# EasyEDA Pro project ProDoc_接收端.epro

# Schematic Schematic1

## Sheets
1 P1: Board Name: 接收端; Create Date: 2025-08-29; Page Name: P1; Project Name: thu硬设魔杖; Schematic Name: Schematic1; Update Date: 2025-08-30; Company: 嘉立创EDA; Page Size: A4; Version: V1.0
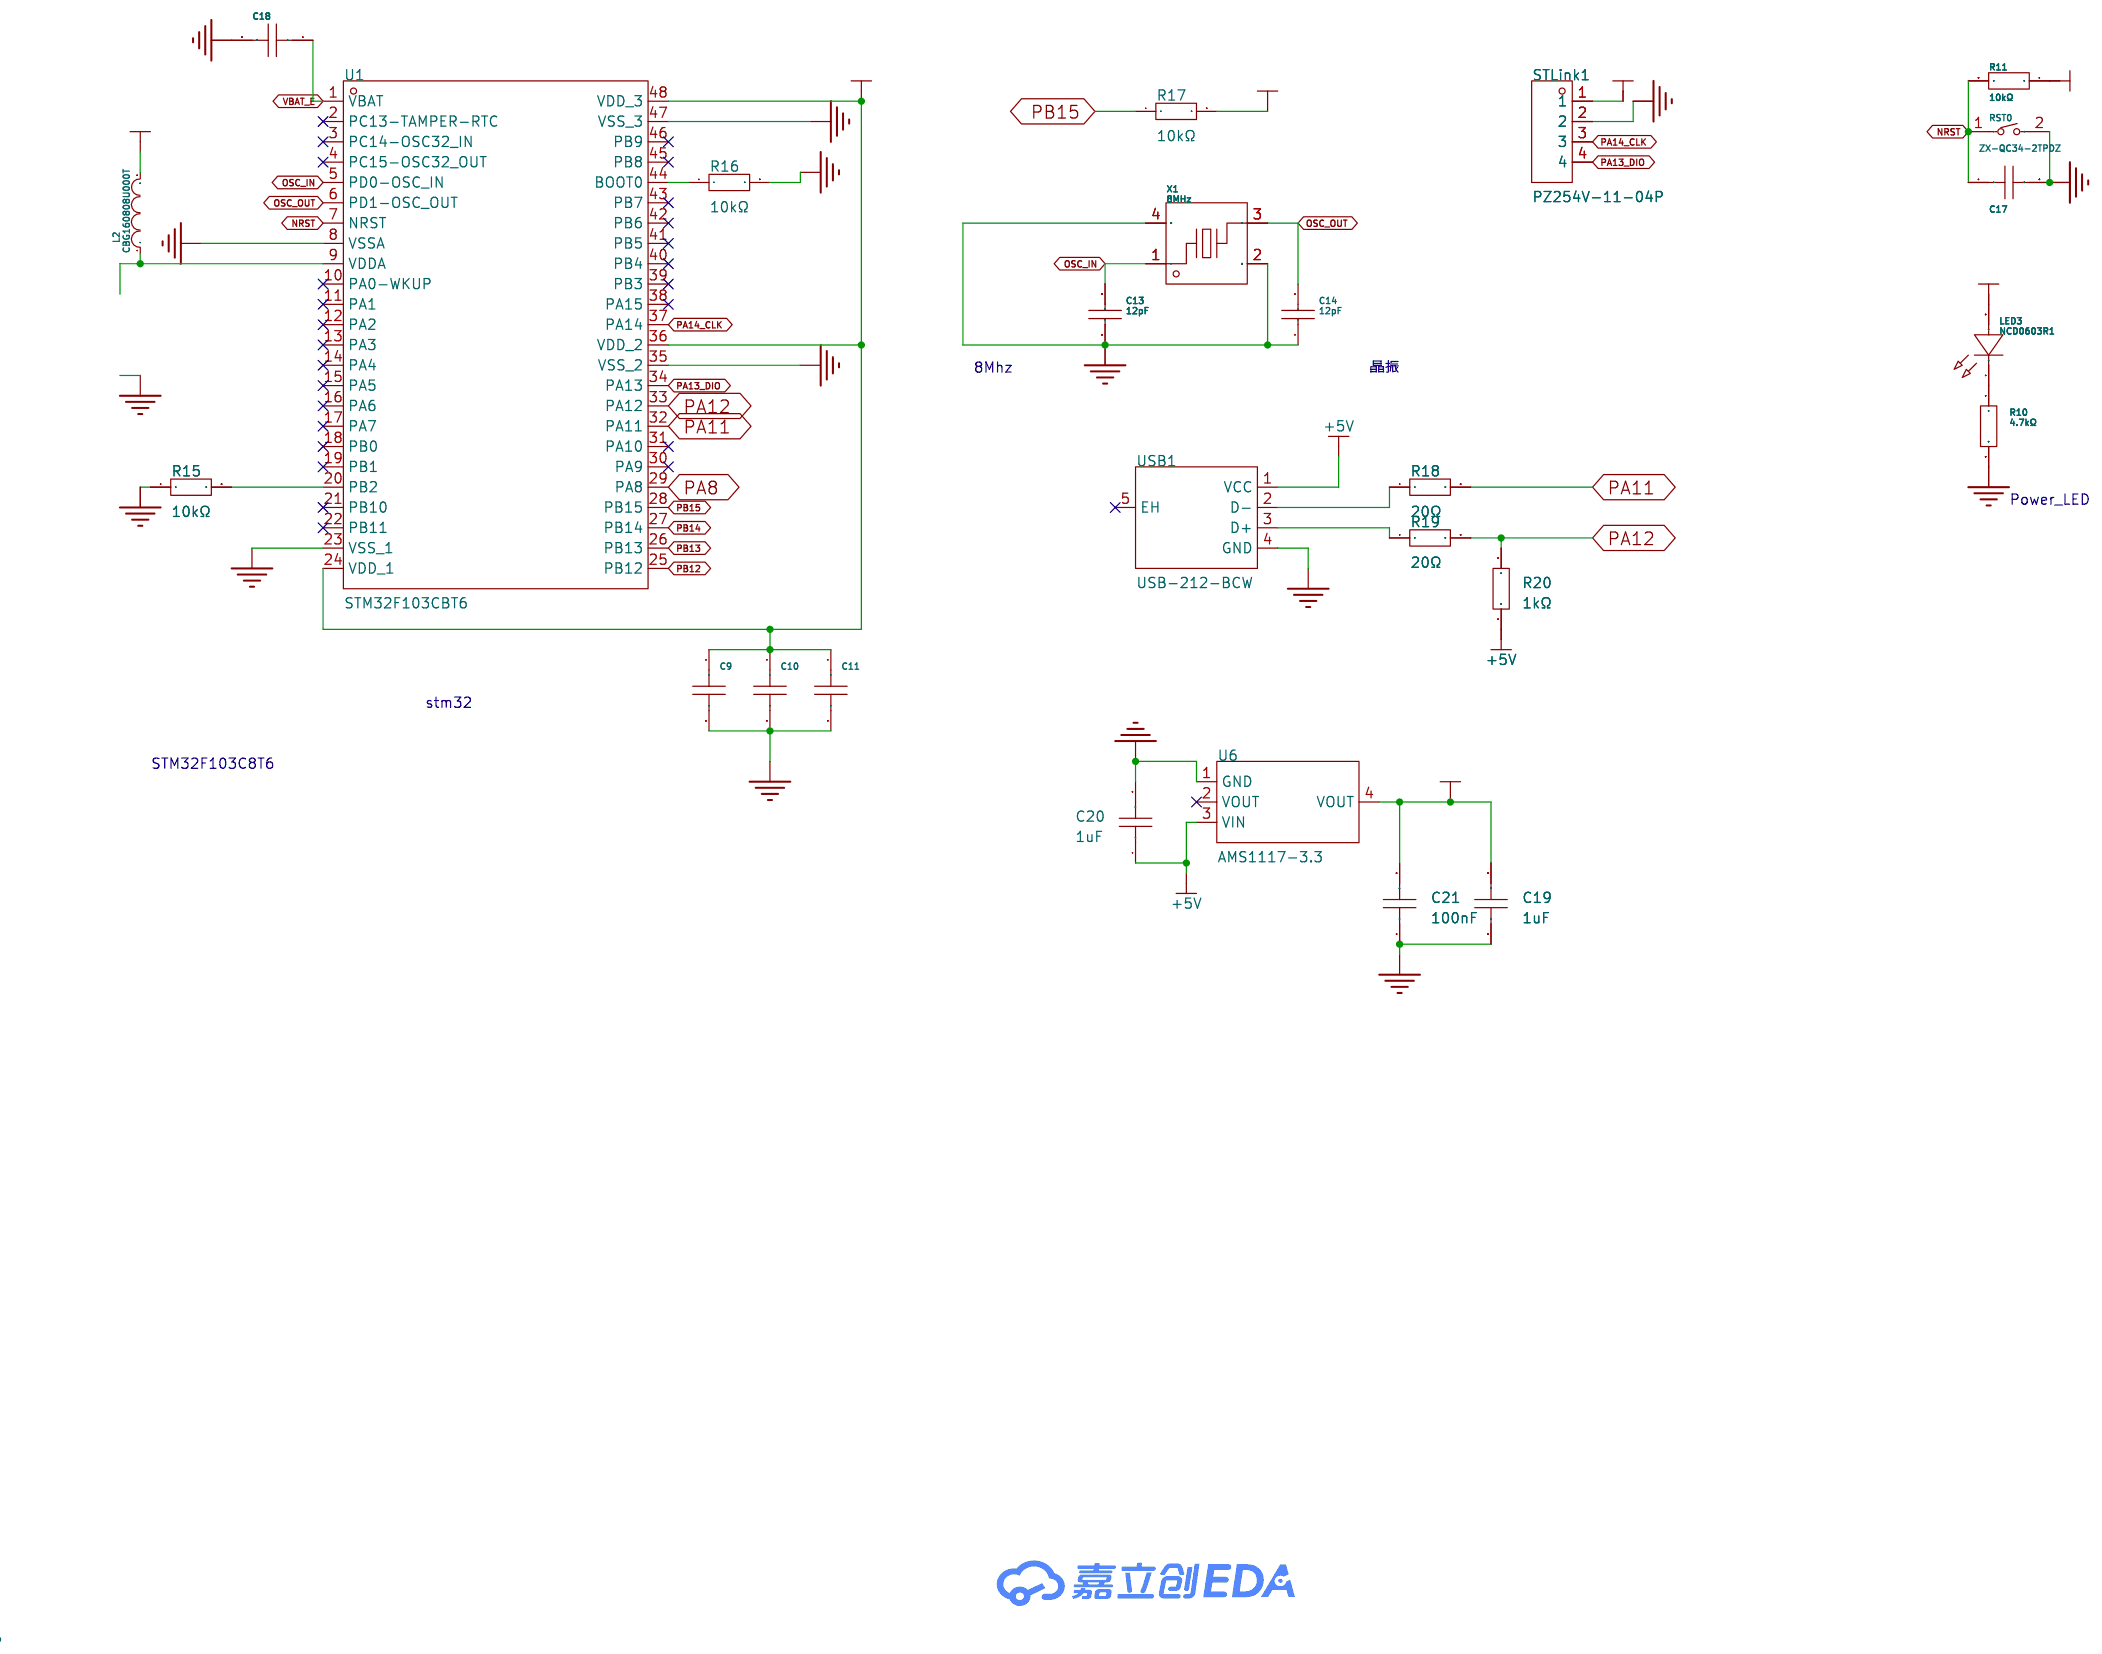
[diagram p0: P1]
2 P2: Page Name: P2; Update Date: 2025-08-29
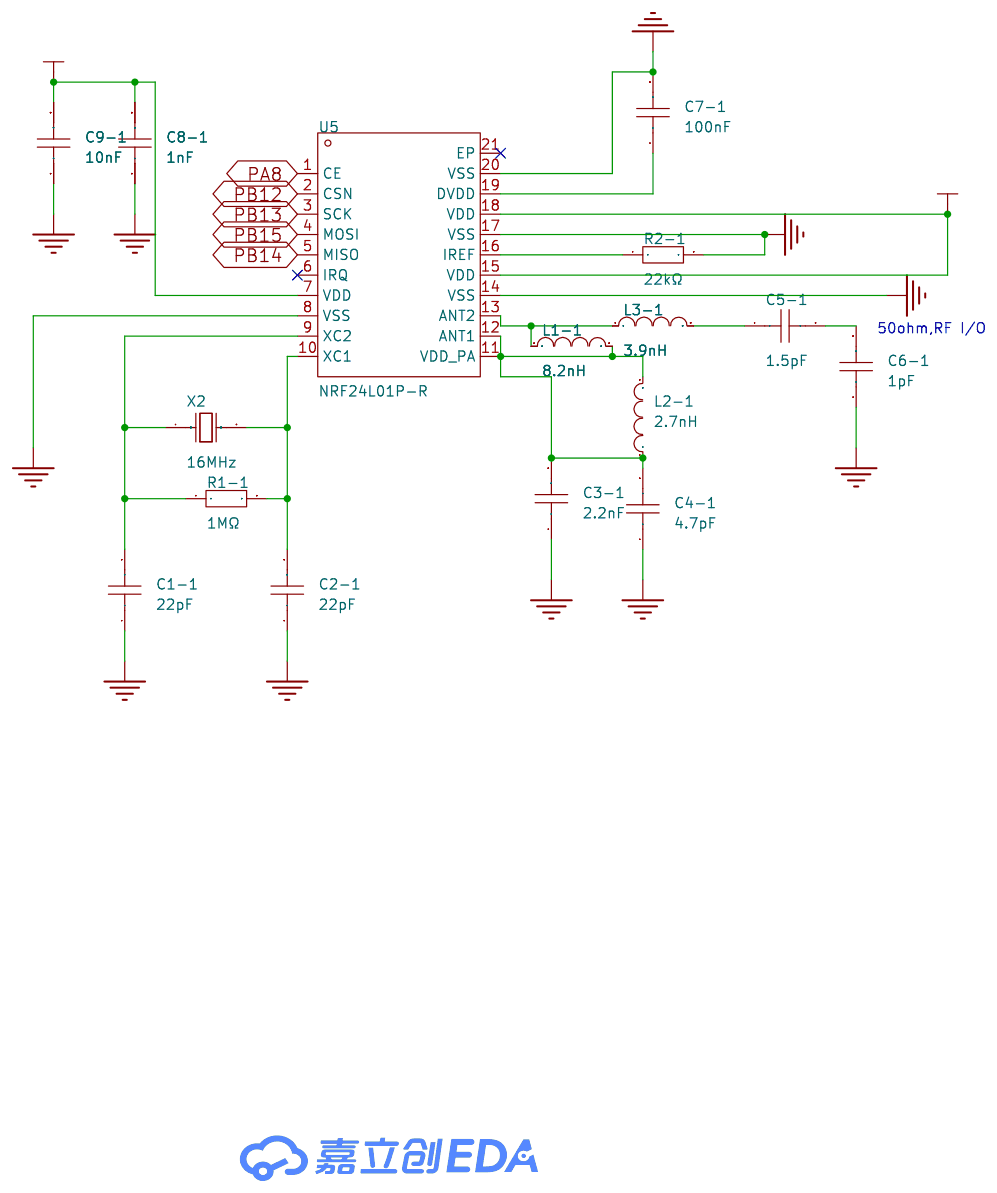
[diagram p1: P2]

## Parts
sheet P1
C9  100nF  [C0603]
C10  100nF  [C0603]
C11  100nF  [C0603]
C13  12pF  [C0603]
C14  12pF  [C0603]
C17  100nF  [C0603]
C18  100nF  [C0603]
C19  1uF  [C0603]
C20  1uF  [C0603]
C21  100nF  [C0603]
L2  CBG160808U000T  [L0603]
LED3  NCD0603R1  [LED0603-RD_RED]
R10  4.7kΩ  [R0603]
R11  10kΩ  [R0603]
R15  10kΩ  [R0603]
R16  10kΩ  [R0603]
R17  10kΩ  [R0603]
R18  20Ω  [R0603]
R19  20Ω  [R0603]
R20  1kΩ  [R0603]
RST0  ZX-QC34-2TPDZ  [KEY-SMD_L3.9-W3.0-LS5.0-EH]
STLink1  PZ254V-11-04P  [HDR-TH_4P-P2.54-V-M]
U1  STM32F103CBT6  [LQFP-48_L7.0-W7.0-P0.50-LS9.0-BL]
U6  AMS1117-3.3  [SOT-223-3_L6.5-W3.4-P2.30-LS7.0-BR]
USB1  USB-212-BCW  [USB-A-SMD_USB-212-BCW]
X1  8MHz  [CRYSTAL-SMD_4P-L3.2-W2.5-BL]
sheet P2
C1-1  22pF  [C0603]
C2-1  22pF  [C0603]
C3-1  2.2nF  [C0603]
C4-1  4.7pF  [C0603]
C5-1  1.5pF  [C0603]
C6-1  1pF  [C0603]
C7-1  100nF  [C0603]
C8-1  1nF  [C0603]
C9-1  10nF  [C0603]
L1-1  8.2nH  [L0603]
L2-1  2.7nH  [L0603]
L3-1  3.9nH  [L0603]
R1-1  1MΩ  [R0603]
R2-1  22kΩ  [R0603]
U5  NRF24L01P-R  [QFN-20_L4.0-W4.0-P0.50-BL-EP]
X2  16MHz  [OSC-TH_L10.0-W4.5-P5.00]

## Library data of the parts
C9-C11 C17 C18 = CT41G-0603-2X1-50V-0.1μF-K(N): 容值:100nF;精度:±10%;额定电压:50V;温度系数:-;; LCSC Part Name: 100nF ±10% 50V; Supplier Part: C125205; Manufacturer: TORCH(火炬); Supplier Footprint: 0603; JLCPCB Part Class: Extended Part; Datasheet: https://atta.szlcsc.com/upload/public/pdf/source/20171225/C150708_15141883600121203188.pdf; Supplier: LCSC; Tolerance: ±10%; Voltage Rating: 50V
C13 C14 = CL10C120JB8NNNC: 容值:12pF;精度:±5%;额定电压:50V;温度系数:C0G;; LCSC Part Name: 12pF ±5% 50V; Supplier Part: C38523; Manufacturer: SAMSUNG(三星); Supplier Footprint: 0603; JLCPCB Part Class: Basic Part; Datasheet: https://item.szlcsc.com/datasheet/CL10C120JB8NNNC/39506.html; Supplier: LCSC; Tolerance: ±5%; Voltage Rating: 50V; Temperature Coefficient: C0G
C19 C20 = CL10A105KB8NNNC: 容值:1uF;精度:±10%;额定电压:50V;温度系数:X5R;; LCSC Part Name: 1uF ±10% 50V; Supplier Part: C15849; Manufacturer: SAMSUNG(三星); Supplier Footprint: 0603; JLCPCB Part Class: 基础库; Datasheet: https://item.szlcsc.com/datasheet/CL10A105KB8NNNC/16531.html; Supplier: LCSC; Tolerance: ±10%; Voltage Rating: 50V; Temperature Coefficient: X5R
C7-1 C21 = CGA0603X7R104K500JT: 容值:100nF;精度:±10%;额定电压:50V;温度系数:X7R;; LCSC Part Name: 100nF ±10% 50V; Supplier Part: C6119867; Manufacturer: HRE(芯声); Supplier Footprint: 0603; JLCPCB Part Class: Extended Part; Datasheet: https://atta.szlcsc.com/upload/public/pdf/source/20250103/C44077DA9E7B3EFAE02F22B6D3D1CBC9.pdf; Supplier: LCSC; Tolerance: ±10%; Voltage Rating: 50V; Temperature Coefficient: X7R
L2 = CBG160808U000T: 标称阻抗@测试频率:0Ω@100MHz;直流电阻(RDC):100mΩ;; LCSC Part Name: 单路 0603磁珠 阻抗0Ω@100MHz; Supplier Part: C43163; Manufacturer: FH(风华); Supplier Footprint: 0603; JLCPCB Part Class: 扩展库; Datasheet: https://atta.szlcsc.com/upload/public/pdf/source/20190129/C361667_1614D407CC98D1D3CFBD9E1F7511C14D.pdf; Supplier: LCSC; Impedance @ Frequency: 0Ω@100MHz; DC Resistance: 100mΩ; Current Rating: 800mA; Circuits: 1
LED3 = NCD0603R1_C84263: 灯头类型:-;发光颜色:红色;正向电压(VF):1.6V~2.6V;功率:65mW;正向电流:20mA;主波长:615nm~630nm;二极管配置:独立二极管;透镜颜色:无色透明透镜;色温:-;发光强度:80mcd~220mcd;发光角度:130°;载带方式:-;工作温度:-30℃~+85℃;; Supplier Part: C84263; Manufacturer: 国星光电; Supplier Footprint: 0603; JLCPCB Part Class: Extended Part; Datasheet: https://atta.szlcsc.com/upload/public/pdf/source/20200820/C84263_DABC6A75E58F576973B407FDBA283D60.pdf; Supplier: LCSC; Emitted Color: 红色; Forward Voltage (VF): 1.6V~2.6V; Power Dissipation: 65mW; Forward Current: 20mA; Dominant Wavelength: 615nm~630nm; Diode Configuration: 独立二极管; Lens Color: 无色透明透镜; Luminous Intensity: 80mcd~220mcd; Viewing Angle: 130°; Operating Temperature: -30℃~+85℃
R10 = 0603WAF4701T5E: 电阻类型:厚膜电阻;阻值:4.7kΩ;精度:±1%;功率:100mW;工作电压:75V;温度系数:±100ppm/℃;; LCSC Part Name: 4.7kΩ ±1% 100mW 厚膜电阻; Supplier Part: C23162; Manufacturer: UNI-ROYAL(厚声); Supplier Footprint: 0603; JLCPCB Part Class: Basic Part; Datasheet: https://item.szlcsc.com/datasheet/0603WAF4701T5E/23889.html; Supplier: LCSC; Type: 厚膜电阻; Tolerance: ±1%; Power(Watts): 100mW; Voltage-Supply(Max): 75V; Temperature Coefficient: ±100ppm/℃; Operating Temperature: -55℃~+155℃
R11 = 0603WAF1002T5E: 电阻类型:厚膜电阻;阻值:10kΩ;精度:±1%;功率:100mW;工作电压:75V;温度系数:±100ppm/℃;; LCSC Part Name: 厚膜电阻 10kΩ ±1% 100mW; Supplier Part: C25804; Manufacturer: UNI-ROYAL(厚声); Supplier Footprint: 0603; JLCPCB Part Class: Basic Part; Datasheet: https://item.szlcsc.com/datasheet/0603WAF1002T5E/26547.html; Supplier: LCSC; Type: 厚膜电阻; Tolerance: ±1%; Power(Watts): 100mW; Overload Voltage (Max): 75V; Temperature Coefficient: ±100ppm/℃; Operating Temperature Range: -55℃~+155℃; Voltage-Supply(Max): 75V; Operating Temperature: -55℃~+155℃
R15-R17 = 0603WAF1002T5E: 电阻类型:厚膜电阻;阻值:10kΩ;精度:±1%;功率:100mW;工作电压:75V;温度系数:±100ppm/℃;; LCSC Part Name: 厚膜电阻 10kΩ ±1% 100mW; Supplier Part: C25804; Manufacturer: UNI-ROYAL(厚声); Supplier Footprint: 0603; JLCPCB Part Class: 基础库; Datasheet: https://atta.szlcsc.com/upload/public/pdf/source/20200306/C422600_1E6D84923E4A46A82E41ADD87F860B5C.pdf; Supplier: LCSC; Type: 厚膜电阻; Tolerance: ±1%; Power(Watts): 100mW; Overload Voltage (Max): 75V; Temperature Coefficient: ±100ppm/℃; Operating Temperature Range: -55℃~+155℃; Voltage-Supply(Max): 75V; Operating Temperature: -55℃~+155℃
R18 R19 = 0603WAF200JT5E: 电阻类型:厚膜电阻;阻值:20Ω;精度:±1%;功率:100mW;最大工作电压:75V;温度系数:±100ppm/℃;; LCSC Part Name: 20Ω ±1% 100mW 厚膜电阻; Supplier Part: C22950; Manufacturer: UNI-ROYAL(厚声); Supplier Footprint: 0603; JLCPCB Part Class: 基础库; Datasheet: https://atta.szlcsc.com/upload/public/pdf/source/20200306/C422600_1E6D84923E4A46A82E41ADD87F860B5C.pdf; Supplier: LCSC; Type: 厚膜电阻; Tolerance: ±1%; Power(Watts): 100mW; Overload Voltage (Max): 75V; Temperature Coefficient: ±100ppm/℃; Operating Temperature Range: -55℃~+155℃
R20 = 0603WAF1001T5E: 电阻类型:厚膜电阻;阻值:1kΩ;精度:±1%;功率:100mW;最大工作电压:75V;温度系数:±100ppm/℃;; LCSC Part Name: 1kΩ ±1% 100mW 厚膜电阻; Supplier Part: C21190; Manufacturer: UNI-ROYAL(厚声); Supplier Footprint: 0603; JLCPCB Part Class: 基础库; Datasheet: https://atta.szlcsc.com/upload/public/pdf/source/20200306/C422600_1E6D84923E4A46A82E41ADD87F860B5C.pdf; Supplier: LCSC; Type: 厚膜电阻; Tolerance: ±1%; Power(Watts): 100mW; Overload Voltage (Max): 75V; Temperature Coefficient: ±100ppm/℃; Operating Temperature Range: -55℃~+155℃
RST0 = ZX-QC34-2TPDZ: 电路结构:单刀单掷;按钮形状:圆形按钮;作用力:2.6N;安装方式:立贴;开关长度:3mm;开关宽度:4mm;开关高度:2mm;带支架:不带;触点电流:50mA;额定电压(AC):250V;额定电压(DC):12V;绝缘电阻:100MΩ;机械寿命:10万次;; LCSC Part Name: 3*4*2贴片开关带柱; Supplier Part: C7470219; Manufacturer: Megastar(兆星); Supplier Footprint: SMD; JLCPCB Part Class: 扩展库; Datasheet: https://atta.szlcsc.com/upload/public/pdf/source/20230724/D2731FAADF93973E25928DE23F241F8A.pdf; Supplier: LCSC; Circuit: 单刀单掷; Actuator Style: 圆形按钮; Operating Force: 2.6N; Mounting Style: 立贴; Switch Length: 3mm; Switch Width: 4mm; Switch Height: 2mm; Strike Gundam: 不带; Contact Current: 50mA; Voltage Rating (AC): 250V; Voltage Rating (DC): 12V; Insulation Resistance: 100MΩ; Actuator/Cap Color: 黑色; Pin Style: 鸥翼型; Mechanical Life: 10万次; Operating Temperature: -30℃~+80℃
STLink1 = PZ254V-11-04P: 插针结构:1x4P;间距:2.54mm;行距:-;圆针/方针:方针;安装类型:直插;排数:单排;总PIN位数:4P;额定电流:3A;额定电压:250V;配合针长度:6mm;塑高:2.5mm;端接针长度:3mm;触头材质:-;工作温度范围:-40℃~+105℃;颜色:黑色;; LCSC Part Name: 间距:2.54mm 1x4P 直插 方针; Supplier Part: C2691448; Manufacturer: XFCN(兴飞); Supplier Footprint: 插件,P=2.54mm; JLCPCB Part Class: 扩展库; Datasheet: https://atta.szlcsc.com/upload/public/pdf/source/20200309/C492403_F9F19131791D08044AD4F84F8E751A34.pdf; Supplier: LCSC; Pin Structure: 1x4P; Pitch: 2.54mm; Circluar Pins/Square Pins: 方针; Mounting Type: 直插; Number of Rows: 单排; Number of Pins: 4P; Current Rating (Max): 3A; Voltage Rating (Max): 250V; Length of Mating Pin: 6mm; Insulation Height: 2.5mm; Length of End Connection Pin: 3mm; Operating Temperature Range: -40℃~+105℃; Color: 黑色
U1 = STM32F103CBT6: CPU内核:ARM-M3;CPU最大主频:72MHz;应用领域:-;; LCSC Part Name: 主流增强型ARM Cortex-M3 MCU，具有128 KB Flash、72 MHz CPU、电机控制、USB和CAN; Supplier Part: C8304; Manufacturer: ST(意法半导体); Supplier Footprint: LQFP-48(7x7); JLCPCB Part Class: Extended Part; Datasheet: https://atta.szlcsc.com/upload/public/pdf/source/20150811/1457707344439.pdf; Supplier: LCSC; CPU Core: ARM-M3; CPU Maximum Speed: 72MHz; Program Storage Size: 128KB; Program Memory Type: FLASH; Number of I/O: 37; ADC (Bit): 12bit; Voltage - Supply: 2V~3.6V; 16Bit Timer: 3; CAN: 1; UART/USART: 3; I2C: 2; SPI: 3
U6 = AMS1117-3.3_C6186: 输出类型:固定;工作电压:16V;输出电压:3.3V;输出电流:1A;电源纹波抑制比(PSRR):72dB@(120Hz);输出极性:正极;; LCSC Part Name: 输出3.3V 1A; Supplier Part: C6186; Manufacturer: AMS; Supplier Footprint: SOT-223; JLCPCB Part Class: 基础库; Datasheet: https://item.szlcsc.com/datasheet/AMS1117-3.3/6652.html; Supplier: LCSC; Output Type: 固定; Voltage - Supply: 16V; Output Voltage: 3.3V; Output Current: 1A; Power Supply Rejection Ratio (PSRR): 72dB@(120Hz); Voltage Dropout: 1.1V@(800mA); standby current: 5mA; Features: 过流保护；过热保护; Operating Temperature: -40℃~+125℃; Output Configuration: 正极; Number of Outputs: 1
USB1 = USB-212-BCW: 连接器类型:Type-A;协议标准:USB 2.0;公母:公;安装方式:卧贴;触点数量:4P;端口数量:1;额定电流 - 电源:1.5A;工作温度:-20℃~+70℃;; LCSC Part Name: Type-A 公 卧贴; Supplier Part: C720521; Manufacturer: XUNPU(讯普); Supplier Footprint: SMD; JLCPCB Part Class: 扩展库; Datasheet: https://item.szlcsc.com/datasheet/USB-212-BCW/763528.html; Supplier: LCSC; Connector Type: Type-A; Protocol Standard: USB 2.0; Gender: 公; Mounting Type: 卧贴; Number of Contacts: 4P; Number of Ports: 1; Current Rating-Power: 1.5A; Operating Temperature: -20℃~+70℃
X1 = X32258MOB4SI: 晶振类型:贴片晶振;频率:8MHz;常温频差:±10ppm;负载电容:12pF;频率稳定度:±20ppm;; LCSC Part Name: YSX321SL 8MHZ 4P 3225 12PF ±10PPM -40~85℃ (±20PPM); Supplier Part: C2682775; Manufacturer: YXC(扬兴晶振); Supplier Footprint: SMD3225-4P; JLCPCB Part Class: Extended Part; Datasheet: https://item.szlcsc.com/datasheet/X32258MOB4SI/2777872.html; Supplier: LCSC; Type: 贴片晶振; Normal temperature Frequency Tolerance: ±10ppm; Load Capacitance: 12pF; Frequency Stability: ±20ppm; Equivalent Series Resistance(ESR): 150Ω; Operating Temperature: -40℃~+85℃
C1-1 C2-1 = CL10C220JB8NNNC: 容值:22pF;精度:±5%;额定电压:50V;温度系数:C0G;; LCSC Part Name: 22pF ±5% 50V; Supplier Part: C1653; Manufacturer: SAMSUNG(三星); Supplier Footprint: 0603; JLCPCB Part Class: Basic Part; Datasheet: https://item.szlcsc.com/datasheet/CL10C220JB8NNNC/2005.html; Supplier: LCSC; Tolerance: ±5%; Voltage Rating: 50V; Temperature Coefficient: C0G
C3-1 = FCC0603B222K500CT: 容值:2.2nF;精度:±10%;额定电压:50V;温度系数:X7R;; LCSC Part Name: 2.2nF ±10% 50V; Supplier Part: C5137562; Manufacturer: FOJAN(富捷); Supplier Footprint: 0603; JLCPCB Part Class: Extended Part; Datasheet: https://atta.szlcsc.com/upload/public/pdf/source/20220818/0EB3B7FB2F5648AC16609637FBA7DABE.pdf; Supplier: LCSC; Tolerance: ±10%; Voltage Rating: 50V; Temperature Coefficient: X7R
C4-1 = 0603CG4R7C500NT: 容值:4.7pF;额定电压:50V;材质(温度系数):C0G;; LCSC Part Name: 4.7pF 50V; Supplier Part: C1669; Manufacturer: FH(风华); Supplier Footprint: 0603; JLCPCB Part Class: Extended Part; Datasheet: https://atta.szlcsc.com/upload/public/pdf/source/20200305/C486355_26A10D38EF8C2A5C37091D0039909270.pdf; Supplier: LCSC; Voltage Rated: 50V; Temperature Coefficient: C0G
C5-1 = 0603CG1R5C500NT: 容值:1.5pF;额定电压:50V;温度系数:C0G;; LCSC Part Name: ±0.25pF 1.5pF 50V; Supplier Part: C1639; Manufacturer: FH(风华); Supplier Footprint: 0603; JLCPCB Part Class: Extended Part; Datasheet: https://atta.szlcsc.com/upload/public/pdf/source/20200305/C486355_26A10D38EF8C2A5C37091D0039909270.pdf; Supplier: LCSC; Voltage Rating: 50V; Temperature Coefficient: C0G
C6-1 = 0603CG1R0C500NT: 容值:1pF;额定电压:50V;材质(温度系数):C0G;; LCSC Part Name: 1pF 50V; Supplier Part: C37117; Manufacturer: FH(风华); Supplier Footprint: 0603; JLCPCB Part Class: Extended Part; Datasheet: https://atta.szlcsc.com/upload/public/pdf/source/20200305/C486355_26A10D38EF8C2A5C37091D0039909270.pdf; Supplier: LCSC; Voltage Rated: 50V; Temperature Coefficient: C0G
C8-1 = CL10B102KB8NNNC: 容值:1nF;精度:±10%;额定电压:50V;温度系数:X7R;; LCSC Part Name: 1nF ±10% 50V; Supplier Part: C1588; Manufacturer: SAMSUNG(三星); Supplier Footprint: 0603; JLCPCB Part Class: Basic Part; Datasheet: https://item.szlcsc.com/datasheet/CL10B102KB8NNNC/1940.html; Supplier: LCSC; Tolerance: ±10%; Voltage Rating: 50V; Temperature Coefficient: X7R
C9-1 = 0603B103K500NT: 容值:10nF;精度:±10%;额定电压:50V;温度系数:X7R;; LCSC Part Name: 10nF ±10% 50V; Supplier Part: C57112; Manufacturer: FH(风华); Supplier Footprint: 0603; JLCPCB Part Class: Basic Part; Datasheet: https://atta.szlcsc.com/upload/public/pdf/source/20200305/C486355_26A10D38EF8C2A5C37091D0039909270.pdf; Supplier: LCSC; Tolerance: ±10%; Voltage Rating: 50V; Temperature Coefficient: X7R
L1-1 = LQG18HN8N2J00D: 电感值:8.2nH;精度:±5%;额定电流:800mA;饱和电流(Isat):-;直流电阻(DCR):200mΩ;; LCSC Part Name: 8.2nH ±5%; Supplier Part: C98009; Manufacturer: muRata(村田); Supplier Footprint: 0603; JLCPCB Part Class: Extended Part; Datasheet: https://atta.szlcsc.com/upload/public/pdf/source/20180326/C98009_7046A2592ACD2B033EC7793A778D5AE4.pdf; Supplier: LCSC; Tolerance: ±5%; Rated Current: 800mA; DC Resistance (DCR): 200mΩ; Q @ Freq: 12@100MHz; Frequency - Self Resonant: 4GHz
L2-1 = SCC1608C2N7SSP: 电感值:2.7nH;额定电流:500mA;饱和电流(Isat):-;直流电阻(DCR):200mΩ;; Supplier Part: C412027; Manufacturer: Sunltech(顺磁); Supplier Footprint: 0603; JLCPCB Part Class: Extended Part; Datasheet: https://atta.szlcsc.com/upload/public/pdf/source/20190819/C412052_7E47CA9107AD18C13168C896A90007C8.pdf; Supplier: LCSC; Current Rating: 500mA; DC Resistance(DCR): 200mΩ
L3-1 = SDCL1608C3N9STDF: 电感值:3.9nH;精度:-;额定电流:500mA;饱和电流(Isat):-;直流电阻(DCR):160mΩ;; LCSC Part Name: 3.9nH ±0.3nH; Supplier Part: C13818; Manufacturer: Sunlord(顺络); Supplier Footprint: 0603; JLCPCB Part Class: Extended Part; Datasheet: https://atta.szlcsc.com/upload/public/pdf/source/20231027/6126A3AAC5912C34388756BE22DEE00C.pdf; Supplier: LCSC; Rated Current: 500mA; DC Resistance(DCR): 160mΩ; Q @ Frequency: 10@100MHz; Frequency - Self Resonant: 6GHz
R1-1 = 0603WAF1004T5E: 电阻类型:厚膜电阻;阻值:1MΩ;精度:±1%;功率:100mW;最大工作电压:75V;温度系数:±100ppm/℃;; LCSC Part Name: 1MΩ ±1% 100mW 厚膜电阻; Supplier Part: C22935; Manufacturer: UNI-ROYAL(厚声); Supplier Footprint: 0603; JLCPCB Part Class: Basic Part; Datasheet: https://atta.szlcsc.com/upload/public/pdf/source/20200306/C422600_1E6D84923E4A46A82E41ADD87F860B5C.pdf; Supplier: LCSC; Type: 厚膜电阻; Tolerance: ±1%; Power(Watts): 100mW; Overload Voltage (Max): 75V; Temperature Coefficient: ±100ppm/℃; Operating Temperature Range: -55℃~+155℃
R2-1 = 0603WAF2202T5E: 电阻类型:厚膜电阻;阻值:22kΩ;精度:±1%;功率:100mW;最大工作电压:75V;温度系数:±100ppm/℃;; LCSC Part Name: 22kΩ ±1% 100mW 厚膜电阻; Supplier Part: C31850; Manufacturer: UNI-ROYAL(厚声); Supplier Footprint: 0603; JLCPCB Part Class: Basic Part; Datasheet: https://atta.szlcsc.com/upload/public/pdf/source/20200306/C422600_1E6D84923E4A46A82E41ADD87F860B5C.pdf; Supplier: LCSC; Type: 厚膜电阻; Tolerance: ±1%; Power(Watts): 100mW; Overload Voltage (Max): 75V; Temperature Coefficient: ±100ppm/℃; Operating Temperature Range: -55℃~+155℃
U5 = NRF24L01P-R: 频率范围:2.4GHz~2.525GHz;接口类型:SPI;应用领域:-;数据速率:2Mbps;灵敏度:-82dBm;典型应用频率:2.4GHz;; LCSC Part Name: 单芯片2.4GHz收发器; Supplier Part: C8791; Manufacturer: NORDIC; Supplier Footprint: QFN-20-EP(4x4); JLCPCB Part Class: Extended Part; Datasheet: https://atta.szlcsc.com/upload/public/pdf/source/20120816/1457706530106.pdf; Supplier: LCSC; Frequency Range: 2.4GHz~2.525GHz; Interface: SPI; Voltage - Supply: 1.9V~3.6V; Output Power: 0dBm; Data Rate: 2Mbps; Current Of Transmitting: 11.3mA; Sensitivity: -82dBm; Receive Current: 13.5mA; Typical Application Frequency: 2.4GHz; Operating Temperature: -40℃~+85℃
X2 = X49SD16MSD2SC: 晶振类型:直插晶振;频率:16MHz;常温频差:±20ppm;负载电容:20pF;频率稳定度:±30ppm;; LCSC Part Name: HC-49US 16MHZ 2P 49S 20PF ±20PPM -20~70℃ (±30PPM); Supplier Part: C16212; Manufacturer: YXC(扬兴晶振); Supplier Footprint: HC-49S; JLCPCB Part Class: Extended Part; Datasheet: https://atta.szlcsc.com/upload/public/pdf/source/20240329/977D7F2434F98B2BE33270BB9FF3D86D.pdf; Supplier: LCSC; Type: 直插晶振; Normal temperature Frequency Tolerance: ±20ppm; Load Capacitance: 20pF; Frequency Stability: ±30ppm; Operating Temperature: -20℃~+70℃

## Nets
3V3: C8-1.2 C9.1 C9-1.2 C10.1 C11.1 C19.2 C21.2 L2.2 LED3.2(A) R11.1 R17.2 STLink1.1 U1.24(VDD_1) U1.36(VDD_2) U1.48(VDD_3) U5.7(VDD) U5.15(VDD) U5.18(VDD) U6.4(VOUT)
+5V: C20.1 R20.1 U6.3(VIN) USB1.1(VCC)
GND: C1-1.1 C2-1.1 C3-1.1 C4-1.1 C6-1.1 C7-1.2 C8-1.1 C9.2 C9-1.1 C10.2 C11.2 C13.1 C14.1 C17.2 C18.2 C19.1 C20.2 C21.1 R2-1.2 R10.2 R15.1 R16.2 RST0.2 STLink1.2 U1.8(VSSA) U1.23(VSS_1) U1.35(VSS_2) U1.47(VSS_3) U5.8(VSS) U5.14(VSS) U5.17(VSS) U5.20(VSS) U6.1(GND) USB1.4(GND) X1.2(GND) X1.4(GND)
VBAT_E: C18.1 U1.1(VBAT)
NRST: C17.1 R11.2 RST0.1 U1.7(NRST)
OSC_IN: C13.2 U1.5(PD0-OSC_IN) X1.1
OSC_OUT: C14.2 U1.6(PD1-OSC_OUT) X1.3
PA8: U1.29(PA8) U5.1(CE)
PA11: R18.2 U1.32(PA11)
PA12: R19.2 R20.2 U1.33(PA12)
PA13_DIO: STLink1.4 U1.34(PA13)
PA14_CLK: STLink1.3 U1.37(PA14)
PB12: U1.25(PB12) U5.2(CSN)
PB13: U1.26(PB13) U5.3(SCK)
PB14: U1.27(PB14) U5.5(MISO)
PB15: R17.1 U1.28(PB15) U5.4(MOSI)
$1N869: L2.1 U1.9(VDDA)
$1N882: R15.2 U1.20(PB2)
$1N883: R16.1 U1.44(BOOT0)
$1N2049: R18.1 USB1.2(D-)
$1N2055: R19.1 USB1.3(D+)
$1N3057: LED3.1(K) R10.1
$2N920: C1-1.2 R1-1.1 U5.9(XC2) X2.1(OSC1)
$2N921: C2-1.2 R1-1.2 U5.10(XC1) X2.2(OSC2)
$2N924: C3-1.2 C4-1.2 L1-1.2 L2-1.1 L2-1.2 U5.11(VDD_PA) U5.12(ANT1)
$2N927: L1-1.1 L3-1.1 U5.13(ANT2)
$2N928: C5-1.1 L3-1.2
$2N929: C5-1.2 C6-1.2
$2N933: R2-1.1 U5.16(IREF)
$2N935: C7-1.1 U5.19(DVDD)

Not connected (* = marked no-connect by the designer): U1 2(PC13-TAMPER-RTC)* 3(PC14-OSC32_IN)* 4(PC15-OSC32_OUT)* 10(PA0-WKUP)* 11(PA1)* 12(PA2)* 13(PA3)* 14(PA4)* 15(PA5)* 16(PA6)* 17(PA7)* 18(PB0)* 19(PB1)* 21(PB10)* 22(PB11)* 30(PA9)* 31(PA10)* 38(PA15)* 39(PB3)* 40(PB4)* 41(PB5)* 42(PB6)* 43(PB7)* 45(PB8)* 46(PB9)*; U5 6(IRQ)* 21(EP)*; U6 2(VOUT)*; USB1 5(EH)*

## Notes on the sheets
sheet 1
- 8Mhz
- 晶振
- Power_LED
- stm32
- STM32F103C8T6
sheet 2
- 50ohm,RF I/O

# Board PCB4
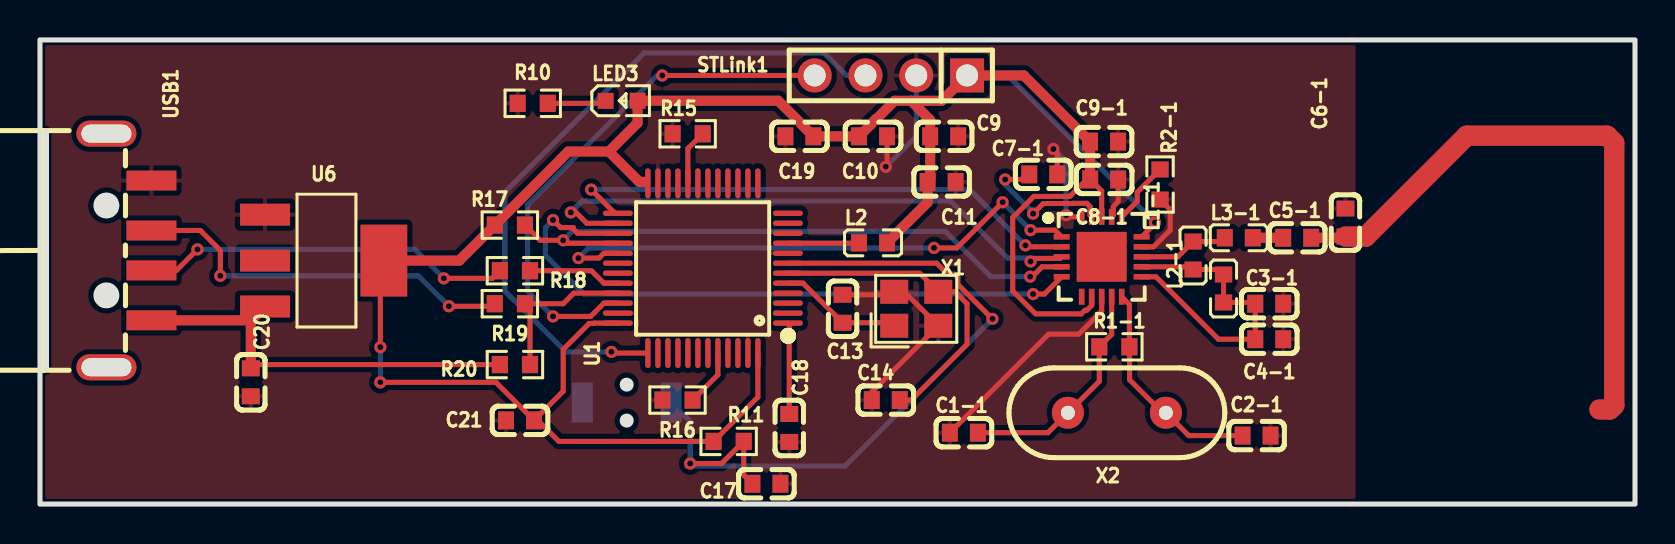
[diagram p2: board, top side]
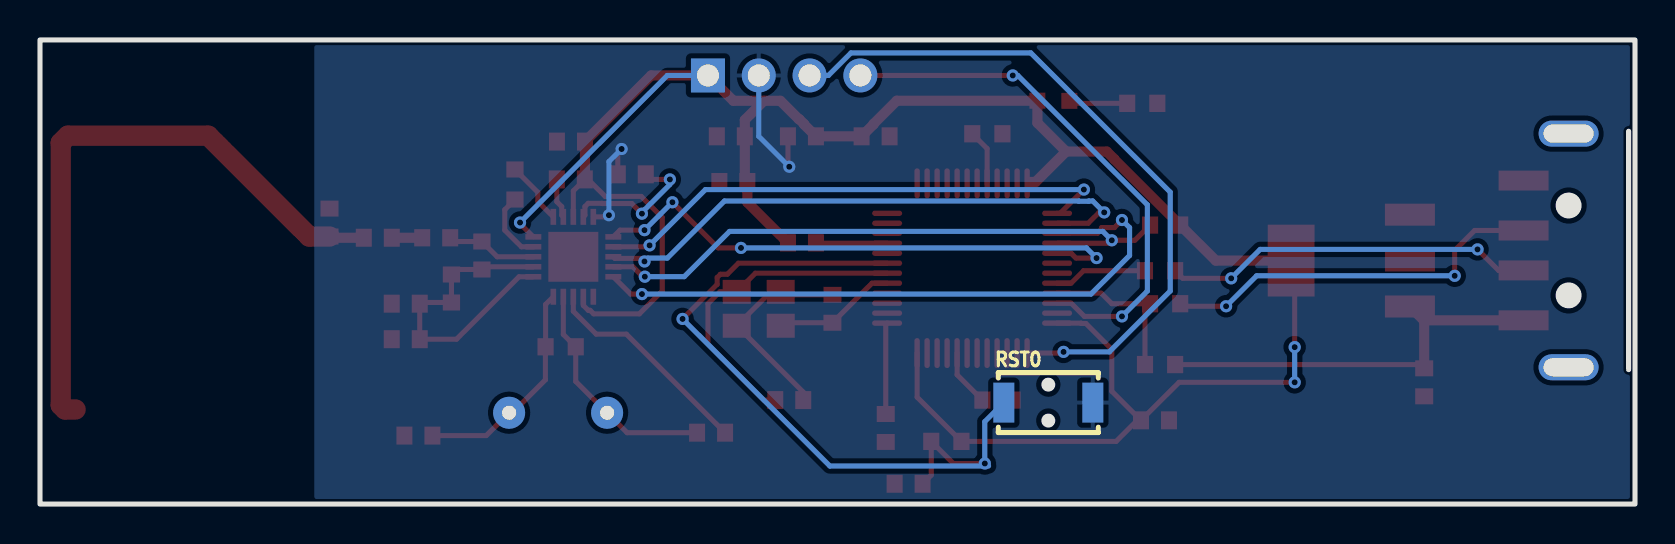
[diagram p3: board, bottom side, seen from below]

Outline 79.76 x 23.24 mm; copper layers: Top Layer, Bottom Layer. Coordinates in mm from the lower left corner of the outline.
Outline path: rectangle 0,23.24 79.76,0
Stack: Top Layer 0.035mm / Dielectric1 1.51mm FR4 er 4.5 / Bottom Layer 0.035mm

## Design rules (mm)
template: JLCPCB Capability(Two Layers Board)
spacing copperThickness1oz (default): track to track 0.102, other pairs 0.152 to 0.3
spacing copperThickness2oz: track to track 0.203, other pairs 0.152 to 0.3
track width copperThickness1oz (default): min 0.127, default 0.254, max 2.54
track width copperThickness2oz: min 0.203, default 0.254, max 2.54
differential pair differentialPair (default): width min 0.127, default 0.254, max 2.54; gap min 0.152, default 0.152
via viaSize (default): diameter min 0.5, default 0.61, max 10; hole min 0.3, default 0.305, max 6.3

## Placement (name value [footprint] x y rotation side)
C1-1  22pF  [C0603]  46.2 3.57 0 top
C2-1  22pF  [C0603]  60.83 3.43 180 top
C3-1  2.2nF  [C0603]  61.47 10.03 180 top
C4-1  4.7pF  [C0603]  61.47 8.26 180 top
C5-1  1.5pF  [C0603]  62.86 13.34 0 top
C6-1  1pF  [C0603]  65.28 14.1 270 top
C7-1  100nF  [C0603]  50.17 16.51 0 top
C8-1  1nF  [C0603]  53.21 16.26 180 top
C9  100nF  [C0603]  45.21 18.42 0 top
C9-1  10nF  [C0603]  53.21 18.15 180 top
C10  100nF  [C0603]  41.66 18.42 0 top
C11  100nF  [C0603]  45.08 16.13 0 top
C13  12pF  [C0603]  40.13 9.78 270 top
C14  12pF  [C0603]  42.29 5.21 0 top
C17  100nF  [C0603]  36.32 1.02 0 top
C18  100nF  [C0603]  37.46 3.81 270 top
C19  1uF  [C0603]  37.97 18.42 0 top
C20  1uF  [C0603]  10.54 6.1 270 top
C21  100nF  [C0603]  24 4.19 0 top
L1-1  8.2nH  [L0603]  57.66 12.45 270 top
L2  CBG160808U000T  [L0603]  41.66 13.08 0 top
L2-1  2.7nH  [L0603]  59.18 10.8 90 top
L3-1  3.9nH  [L0603]  59.94 13.34 0 top
LED3  NCD0603R1  [LED0603-RD_RED]  29.08 20.19 0 top
R1-1  1MΩ  [R0603]  53.72 7.87 0 top
R2-1  22kΩ  [R0603]  56.01 16 270 top
R10  4.7kΩ  [R0603]  24.64 20.07 180 top
R11  10kΩ  [R0603]  34.44 3.14 0 top
R15  10kΩ  [R0603]  32.39 18.54 0 top
R16  10kΩ  [R0603]  31.88 5.21 180 top
R17  10kΩ  [R0603]  23.49 13.97 180 top
R18  20Ω  [R0603]  23.75 11.68 0 top
R19  20Ω  [R0603]  23.49 10.03 0 top
R20  1kΩ  [R0603]  23.75 6.98 0 top
RST0  ZX-QC34-2TPDZ  [KEY-SMD_L3.9-W3.0-LS5.0-EH]  29.34 5.08 180 bottom
STLink1  PZ254V-11-04P  [HDR-TH_4P-P2.54-V-M]  42.55 21.46 180 top
U1  STM32F103CBT6  [LQFP-48_L7.0-W7.0-P0.50-LS9.0-BL]  33.15 11.81 90 top
U5  NRF24L01P-R  [QFN-20_L4.0-W4.0-P0.50-BL-EP]  53.09 12.38 270 top
U6  AMS1117-3.3  [SOT-223-3_L6.5-W3.4-P2.30-LS7.0-BR]  14.22 12.19 180 top
USB1  USB-212-BCW  [USB-A-SMD_USB-212-BCW]  4.45 12.7 270 top
X1  8MHz  [CRYSTAL-SMD_4P-L3.2-W2.5-BL]  43.82 9.78 0 top
X2  16MHz  [OSC-TH_L10.0-W4.5-P5.00]  53.85 4.57 90 top

## Footprints (pads in the part's own frame, mm; a bottom-side part is the same pattern mirrored in y, then rotated)
C0603
  rect 0.8x0.9 smd: 1(-0.7,0) 2(0.7,0)
CRYSTAL-SMD_4P-L3.2-W2.5-BL
  rect 1.4x1.2 smd: 1(-1.1,-0.85) 2(1.1,-0.85) 3(1.1,0.85) 4(-1.1,0.85)
HDR-TH_4P-P2.54-V-M
  rect 1.7x1.7 hole 1.1: 1(-3.81,0)
  round 1.7 hole 1.1: 2(-1.27,0) 3(1.27,0) 4(3.81,0)
KEY-SMD_L3.9-W3.0-LS5.0-EH
  rect 1.05x2 smd: 1(-2.225,0) 2(2.225,0)
L0603
  rect 0.8x0.864 smd: 1(-0.7,0) 2(0.7,0)
LED0603-RD_RED
  rect 0.8x0.8 smd: 1(-0.799,-0.004) 2(0.799,0.004)
LQFP-48_L7.0-W7.0-P0.50-LS9.0-BL
  oval 0.27x1.5 smd: 1(-2.75,-4.25) 2(-2.25,-4.25) 3(-1.75,-4.25) 4(-1.25,-4.25) 5(-0.75,-4.25) 6(-0.25,-4.25) 7(0.25,-4.25) 8(0.75,-4.25) 9(1.25,-4.25) 10(1.75,-4.25) 11(2.25,-4.25) 12(2.75,-4.25) 25(2.75,4.25) 26(2.25,4.25) 27(1.75,4.25) 28(1.25,4.25) 29(0.75,4.25) 30(0.25,4.25) 31(-0.25,4.25) 32(-0.75,4.25) 33(-1.25,4.25) 34(-1.75,4.25) 35(-2.25,4.25) 36(-2.75,4.25)
  oval 1.5x0.27 smd: 13(4.25,-2.75) 14(4.25,-2.25) 15(4.25,-1.75) 16(4.25,-1.25) 17(4.25,-0.75) 18(4.25,-0.25) 19(4.25,0.25) 20(4.25,0.75) 21(4.25,1.25) 22(4.25,1.75) 23(4.25,2.25) 24(4.25,2.75) 37(-4.25,2.75) 38(-4.25,2.25) 39(-4.25,1.75) 40(-4.25,1.25) 41(-4.25,0.75) 42(-4.25,0.25) 43(-4.25,-0.25) 44(-4.25,-0.75) 45(-4.25,-1.25) 46(-4.25,-1.75) 47(-4.25,-2.25) 48(-4.25,-2.75)
OSC-TH_L10.0-W4.5-P5.00
  round 1.6 hole 0.7: 1(0,2.45) 2(0,-2.45)
QFN-20_L4.0-W4.0-P0.50-BL-EP
  rect 0.28x0.8 smd: 1(-1,-2) 2(-0.5,-2) 3(0,-2) 4(0.5,-2) 5(1,-2) 11(1,2) 12(0.5,2) 13(0,2) 14(-0.5,2) 15(-1,2)
  rect 0.8x0.28 smd: 6(2,-1) 7(2,-0.5) 8(2,0) 9(2,0.5) 10(2,1) 16(-2,1) 17(-2,0.5) 18(-2,0) 19(-2,-0.5) 20(-2,-1)
  rect 2.5x2.5 smd: 21(0,0)
R0603
  rect 0.806x0.864 smd: 1(-0.753,0) 2(0.753,0)
SOT-223-3_L6.5-W3.4-P2.30-LS7.0-BR
  rect 2.5x1.1 smd: 1(2.97,-2.3) 2(2.97,0) 3(2.97,2.3)
  rect 2.34x3.6 smd: 4(-2.97,0)
USB-A-SMD_USB-212-BCW
  rect 1x2.5 smd: 1(3.5,1.125) 2(1,1.125) 3(-1,1.125) 4(-3.5,1.125)
  oval 1.3x3 hole 0.9x2.5: 5(-5.85,-1.125) 5(5.85,-1.125)

## Nets
As in the schematic.

Pads without a net: U1 2 3 4 12 13 14 15 38 39 40 45 46; U5 6 21; U6 2; USB1 5

## Via types
v1: diameter 0.61, hole 0.305, Top Layer to Bottom Layer, 29 vias

## Routing (per net, layer and track width the routed paths; a pad name or vN(x,y) marks a point on that pad's centre or on a via; arc(x,y) is an arc through that point)
3V3: length 121.2
  Top Layer w0.254: U5.15 55.75,14.05 v1(55.75,14.1) ; U6.4 17.02,12.02 v1(17.02,7.86) ; C21.2 22.8,6.1 v1(17.02,6.1) ; C21.2 24.89,4.19 25.95,3.14 R11.1 35.9,5.35 U1.48 ; C21.2 26.16,5.65 26.16,7.75 27.46,9.04 27.68,9.04 27.7,9.06 U1.36 ; U5.18 53.09,15.68 C8-1.2 52.35,16.26 51.49,15.41 49.7,15.41 48.64,14.35 48.64,10.67 49.78,9.53 52.07,9.53 52.25,9.7 52.34,9.7 52.59,9.95 U5.7
  Top Layer w0.508: 43.55,20.19 45.08,20.19 STLink1.1 49.19,21.46 C9-1.2 52.51,16.26 C8-1.2 ; 43.55,20.19 44.51,19.23 C9.1 44.51,16.26 C11.1 44.39,15.11 L2.2 ; 43.55,20.19 42.73,20.19 41.81,19.27 41.79,19.27 41.55,19.03 41.55,19.01 C10.1 C19.2 38.08,19.01 38.08,19.03 36.92,20.2 LED3.2 29.88,19.09 28.45,17.65 ; 28.45,17.65 29.97,16.13 30.23,16.13 ; 28.45,17.65 26.42,17.65 26.04,17.27 26.04,17.26 R17.2 20.96,12.19 U6.4
  Bottom Layer w0.254: v1(17.02,7.86) v1(17.02,6.1) ; v1(55.75,14.1) 48.39,21.46 STLink1.1
+5V: length 20.9
  Top Layer w0.254: R20.1 10.73,6.98 C20.1
  Top Layer w0.508: USB1.1 10.56,9.2 ; 10.56,9.2 U6.3 ; 10.56,9.2 10.54,9.18 C20.1
GND: length 39.5
  Top Layer w0.254: C7-1.2 50.86,17.59 v1(50.67,17.78) ; C10.2 42.36,16.96 v1(42.29,16.89) ; C1-1.1 50.43,8.51 51.94,8.51 53.09,9.65 U5.8 ; R2-1.2 56.52,14.74 56.52,13.72 55.68,12.88 U5.14 ; v1(51.31,14.47) 51.39,14.38 U5.20 ; 41.59,5.21 41.59,5.61 X1.2 43.21,10.63 42.71,10.63 42.57,10.48 C13.1 ; C8-1.1 53.91,15.14 53.67,14.9 53.67,14.46 U5.17
  Bottom Layer w0.254: v1(42.29,16.89) 43.82,18.42 STLink1.2 ; v1(51.31,14.47) 51.31,17.14 v1(50.67,17.78)
VBAT_E: length 4.6
  Top Layer w0.254: U1.1 37.46,8.99 C18.1
NRST: length 38.8
  Top Layer w0.254: C17.1 35.19,1.45 R11.2 34.08,2.03 v1(32.51,2.03) ; v1(47.63,9.27) 45.89,11 45.89,11.34 45.73,11.51 45.39,11.51 44.83,12.06 U1.7
  Bottom Layer w0.254: 32.32,1.91 40.26,1.91 v1(47.63,9.27) ; v1(32.51,2.03) 32.51,4.13 RST0.1
OSC_IN: length 6.2
  Top Layer w0.254: 42.71,8.93 42.57,9.08 C13.2 38.15,11.06 U1.5
OSC_OUT: length 16.1
  Top Layer w0.254: U1.6 43.98,11.56 44.92,10.63 45.76,10.63 46.36,10.03 46.36,8 43.56,5.21 C14.2
PA8: length 28.1
  Top Layer w0.254: v1(49.53,13.72) 50.75,13.72 U5.1 ; U1.29 28.2,12.56 27.95,12.32 v1(26.92,12.32) ; v1(44.7,12.83) 45.85,12.83 v1(48.13,15.11)
  Bottom Layer w0.254: v1(26.92,12.32) 27.43,12.83 v1(44.7,12.83) ; v1(49.53,13.72) v1(48.13,15.11)
PA11: length 4.7
  Top Layer w0.254: R18.2 27.57,11.68 28.2,11.06 U1.32
PA12: length 8
  Top Layer w0.254: U1.33 26.69,10.56 26.16,10.03 R19.2 24.5,9.78 R20.2
PA13_DIO: length 26.7
  Top Layer w0.254: U1.34 28.2,10.06 27.53,9.4 v1(25.65,9.4) ; v1(31.11,21.46) STLink1.4
  Bottom Layer w0.254: v1(31.11,21.46) 30.86,21.46 24.38,14.99 24.38,10.67 v1(25.65,9.4)
PA14_CLK: length 34.8
  Top Layer w0.254: U1.37 28.63,7.56 v1(28.58,7.62)
  Bottom Layer w0.254: STLink1.3 40.33,21.46 39.2,22.59 30.21,22.59 23.24,15.62 23.24,10.67 26.29,7.62 v1(28.58,7.62)
PB12: length 26.5
  Top Layer w0.254: v1(27.56,15.75) 28.75,14.56 U1.25 ; U5.2 49.35,12.88 v1(49.28,12.95)
  Bottom Layer w0.254: v1(27.56,15.75) 46.48,15.75 v1(49.28,12.95)
PB13: length 28.7
  Top Layer w0.254: U5.3 51.01,12.3 49.68,12.3 v1(49.53,12.15) ; U1.26 27.34,14.06 26.8,14.61 v1(26.54,14.61)
  Bottom Layer w0.254: v1(26.54,14.61) 27.11,15.18 27.3,15.18 27.32,15.16 27.8,15.16 27.81,15.18 45.53,15.18 48.39,12.32 49.36,12.32 v1(49.53,12.15)
PB14: length 32.5
  Top Layer w0.254: U5.5 50.22,10.52 v1(49.66,10.52) ; U1.27 26.88,13.56 26.67,13.77 26.67,13.84 26.04,13.84 v1(25.65,14.22)
  Bottom Layer w0.254: v1(25.65,14.22) 25.27,13.84 25.27,12.45 27.2,10.52 v1(49.66,10.52)
PB15: length 31.3
  Top Layer w0.254: U5.4 50.11,11.88 49.61,11.39 v1(49.51,11.39) ; U1.28 26.31,13.06 v1(26.16,13.21) 25.01,13.21 R17.1
  Bottom Layer w0.254: v1(49.51,11.39) 47.54,11.39 45.28,13.65 26.61,13.65 v1(26.16,13.21)
$1N869: length 3.6
  Top Layer w0.254: L2.1 40.94,13.06 U1.9
$1N882: length 2.8
  Top Layer w0.254: U1.20 32.4,17.8 R15.2
$1N883: length 2.9
  Top Layer w0.254: U1.44 33.9,6.47 R16.1
$1N2049: length 18.6
  Top Layer w0.254: v1(20.19,11.3) 22.61,11.3 R18.1 ; v1(7.87,12.75) 6.82,11.7 USB1.2
  Bottom Layer w0.254: v1(20.19,11.3) 18.74,12.75 v1(7.87,12.75)
$1N2055: length 19.5
  Top Layer w0.254: R19.1 22.61,9.91 v1(20.45,9.91) ; USB1.3 8.02,13.7 9.02,12.7 v1(9.02,11.43)
  Bottom Layer w0.254: v1(20.45,9.91) 18.92,11.43 v1(9.02,11.43)
$1N3057: length 2.9
  Top Layer w0.254: R10.1 28.16,20.07 LED3.1
$2N920: length 11.6
  Top Layer w0.254: C1-1.2 50.4,3.57 X2.1 52.97,6.14 R1-1.1 53.59,8.49 U5.9
$2N921: length 11.1
  Top Layer w0.254: U5.10 54.47,10 R1-1.2 54.48,7.87 54.48,6.22 56.13,4.57 X2.2 57.44,3.43 C2-1.2
$2N924: length 16
  Top Layer w0.254: U5.11 55.8,11.38 58.93,8.26 C4-1.2 C3-1.2 60.71,10.09 L2-1.1 L2-1.2 58.93,11.75 L1-1.2 57.52,11.88 U5.12
$2N927: length 4.6
  Top Layer w0.254: L3-1.1 59.05,13.15 L1-1.1 56.89,12.38 U5.13
$2N928: length 1.5
  Top Layer w0.508: L3-1.2 C5-1.1
$2N929: length 31.4
  Top Layer w0.508: 63.57,13.34 65.22,13.34 C6-1.2
  Top Layer w1.016: 77.98,4.74 78.5,4.74 78.72,4.95 78.72,18.09 78.36,18.45 71.34,18.45 66.29,13.4 C6-1.2
$2N933: length 3.2
  Top Layer w0.254: R2-1.1 54.86,15.61 54.86,15.16 U5.16
$2N935: length 7.2
  Top Layer w0.254: U5.19 52.51,14.46 52.51,14.9 52.34,15.06 51.65,15.06 51.64,15.05 50.17,15.05 v1(49.66,14.54) ; v1(48.26,16.26) 49.52,16.26 49.53,16.26
  Bottom Layer w0.254: v1(48.26,16.26) 48.26,16 49.53,14.73 49.53,14.67 v1(49.66,14.54)

## Copper pours and planes (outline as drawn; the poured copper is in the pictures)
GND on Top Layer: -1.78,27.43 65.79,27.43 65.79,-3.81 -1.78,-3.81
GND on Bottom Layer: -1.4,26.8 66.04,26.8 66.04,-1.65 -1.4,-1.65
